# Altium schematic sheet 1_P1.schdoc
size 307 x 218 mm; Symbol: Drawing-Symbol_A4; Device: Drawing-Symbol_A4; Company: wenfeng110402; Drawed: 叶文峰; Reviewed: 叶文峰; Version: V1.0; Page Size: A4; @Project Name: hackpod; @Page Count: 1; @Update Date: 2025-12-13; @Create Date: 2025-11-21; @Schematic Name: Schematic1; @Page No: 1; @Page Name: P1; @Board Name: Board1; @Create Time: 22:44:27; @Update Time: 21:42:18; Title Block Position: 3; Size: A4; Width: 1170; Height: 825; Region Start: 1; X Region Count: 6; Y Region Count: 4; Blade Width: 10
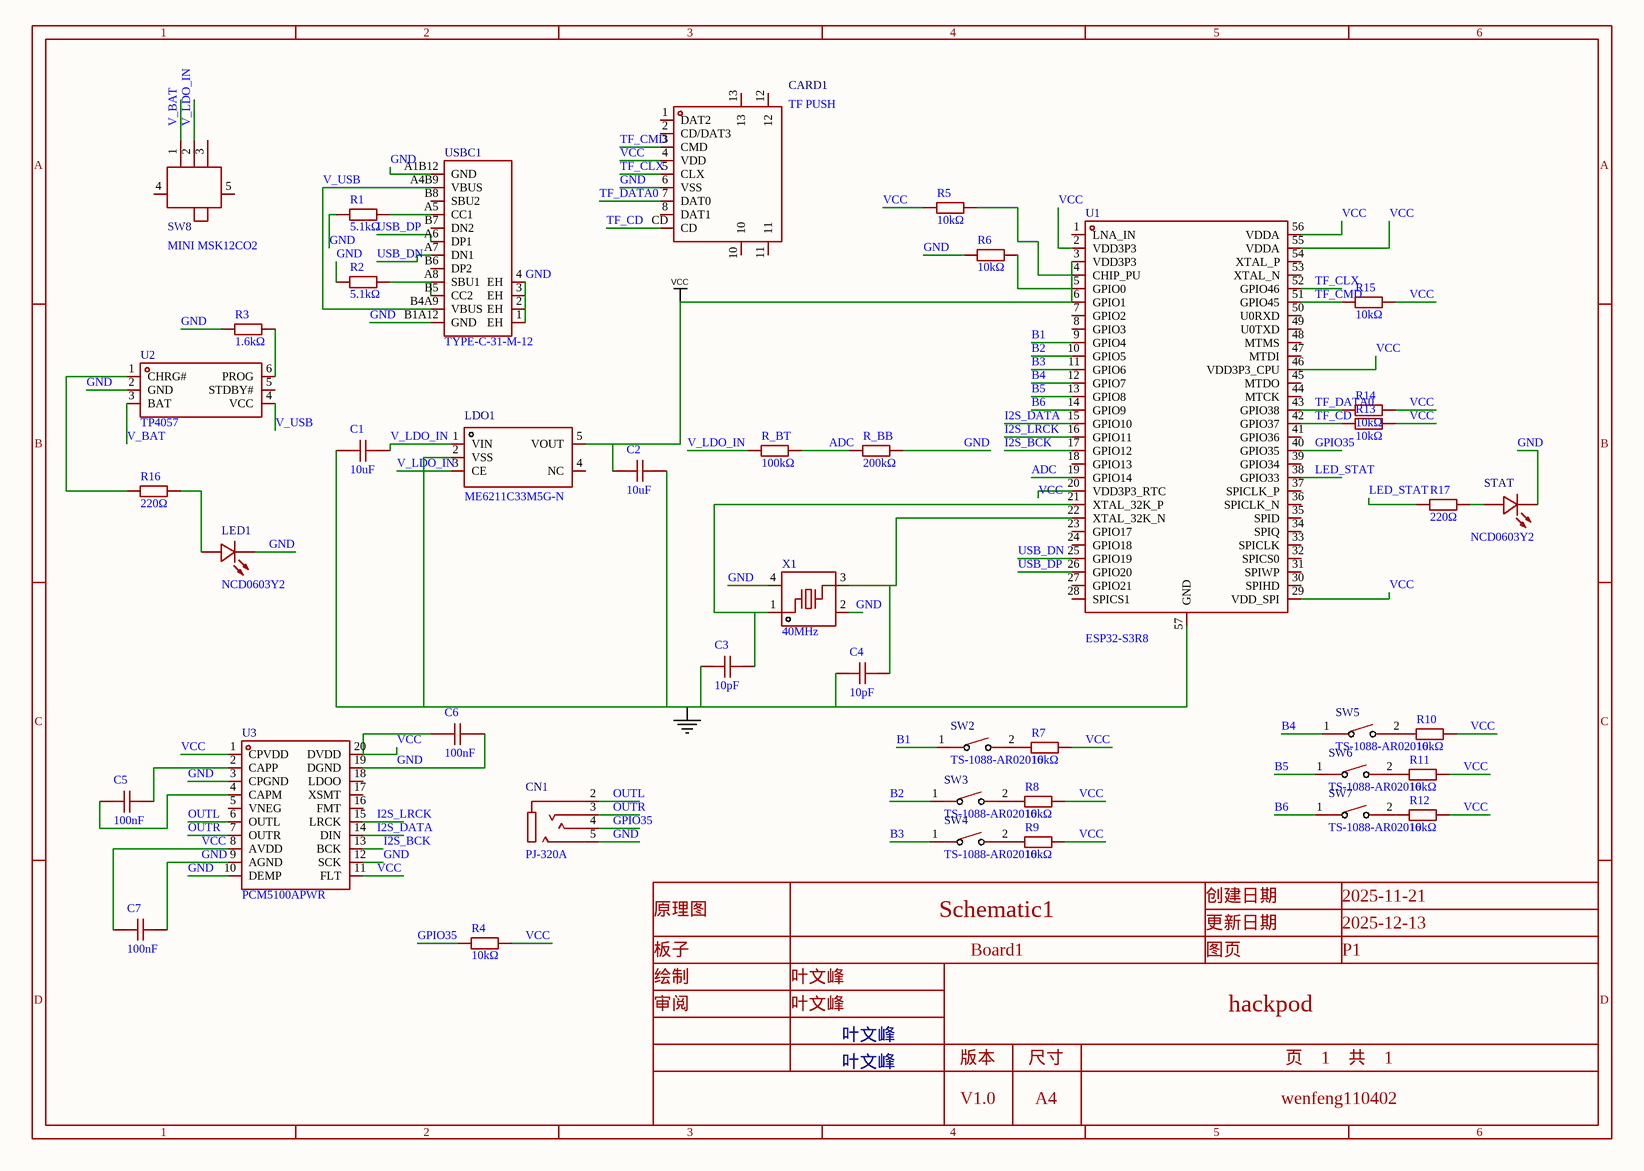
[diagram p0: 1_P1.schdoc]

## Parts
C1  10uF  [C0603]
C2  10uF  [C0603]
C3  10pF  [C0603]
C4  10pF  [C0603]
C5  100nF  [C0603]
C6  100nF  [C0603]
C7  100nF  [C0603]
CARD1  TF PUSH  [TF-SMD_TF-PUSH]
CN1  PJ-320A  [AUDIO-TH_PJ-320A_C49284721]
LDO1  ME6211C33M5G-N  [SOT-23-5_L3.0-W1.7-P0.95-LS2.8-BL]
LED1  NCD0603Y2  [LED0603-RD]
R1  5.1kΩ  [R0603]
R2  5.1kΩ  [R0603]
R3  1.6kΩ  [R0603]
R4  10kΩ  [R0603]
R5  10kΩ  [R0603]
R6  10kΩ  [R0603]
R7  10kΩ  [R0603]
R8  10kΩ  [R0603]
R9  10kΩ  [R0603]
R10  10kΩ  [R0603]
R11  10kΩ  [R0603]
R12  10kΩ  [R0603]
R13  10kΩ  [R0603]
R14  10kΩ  [R0603]
R15  10kΩ  [R0603]
R16  220Ω  [R0603]
R17  220Ω  [R0603]
R_BB  200kΩ  [R0603]
R_BT  100kΩ  [R0603]
STAT  NCD0603Y2  [LED0603-RD]
SW2  TS-1088-AR02016  [SW-SMD_L3.9-W3.0-P4.45]
SW3  TS-1088-AR02016  [SW-SMD_L3.9-W3.0-P4.45]
SW4  TS-1088-AR02016  [SW-SMD_L3.9-W3.0-P4.45]
SW5  TS-1088-AR02016  [SW-SMD_L3.9-W3.0-P4.45]
SW6  TS-1088-AR02016  [SW-SMD_L3.9-W3.0-P4.45]
SW7  TS-1088-AR02016  [SW-SMD_L3.9-W3.0-P4.45]
SW8  MINI MSK12CO2  [SW-SMD_MSK12CO2]
U1  ESP32-S3R8  [QFN-56_L7.0-W7.0-P0.40-TL-EP4.0]
U2  TP4057  [SOT-23-6_L2.9-W1.6-P0.95-LS2.8-BR]
U3  PCM5100APWR  [TSSOP-20_L6.5-W4.4-P0.65-LS6.4-BL]
USBC1  TYPE-C-31-M-12  [USB-C_SMD-TYPE-C-31-M-12_1]
X1  40MHz  [CRYSTAL-SMD_4P-L3.2-W2.5-BL]

## Nets
GND: C1.1 C2.2 C3.1 C4.1 C6.2 C7.2 CARD1.6(VSS) CN1.5 LDO1.2(VSS) LED1.1(K) R1.1 R2.1 R3.1 R6.1 R_BB.2 STAT.1(K) U1.57(GND) U2.2(GND) U3.3(CPGND) U3.9(AGND) U3.10(DEMP) U3.12(SCK) U3.19(DGND) USBC1.1(EH) USBC1.2(EH) USBC1.3(EH) USBC1.4(EH) USBC1.A1B12(GND) USBC1.B1A12(GND) X1.2(GND) X1.4(GND)
VCC: C2.1 C6.1 C7.1 CARD1.4(VDD) LDO1.5(VOUT) R4.2 R5.1 R5.2 R6.2 R7.2 R8.2 R9.2 R10.2 R11.2 R12.2 R13.2 R14.2 R15.2 U1.2(VDD3P3) U1.3(VDD3P3) U1.4(CHIP_PU) U1.5(GPIO0) U1.6(GPIO1) U1.20(VDD3P3_RTC) U1.29(VDD_SPI) U1.46(VDD3P3_CPU) U1.55(VDDA) U1.56(VDDA) U3.1(CPVDD) U3.8(AVDD) U3.11(FLT) U3.20(DVDD)
ADC: R_BB.1 R_BT.2 U1.19(GPIO14)
B1: SW2.1 U1.9(GPIO4)
B2: SW3.1 U1.10(GPIO5)
B3: SW4.1 U1.11(GPIO6)
B4: SW5.1 U1.12(GPIO7)
B5: SW6.1 U1.13(GPIO8)
B6: SW7.1 U1.14(GPIO9)
GPIO35: CN1.4 R4.1 U1.40(GPIO35)
I2S_BCK: U1.17(GPIO12) U3.13(BCK)
I2S_DATA: U1.15(GPIO10) U3.14(DIN)
I2S_LRCK: U1.16(GPIO11) U3.15(LRCK)
LED_STAT: R17.1 U1.38(GPIO33)
OUTL: CN1.2 U3.6(OUTL)
OUTR: CN1.3 U3.7(OUTR)
TF_CD: CARD1.CD R13.1 U1.42(GPIO37)
TF_CLX: CARD1.5(CLX) U1.52(GPIO46)
TF_CMD: CARD1.3(CMD) R15.1 U1.51(GPIO45)
TF_DATA0: CARD1.7(DAT0) R14.1 U1.43(GPIO38)
USB_DN: U1.25(GPIO19) USBC1.A7(DN1)
USB_DP: U1.26(GPIO20) USBC1.A6(DP1)
V_BAT: SW8.1 U2.3(BAT)
V_LDO_IN: C1.2 LDO1.1(VIN) LDO1.3(CE) R_BT.1 SW8.2
V_USB: U2.4(VCC) USBC1.A4B9(VBUS) USBC1.B4A9(VBUS)
NetC3_2: C3.2 U1.21(XTAL_32K_P) X1.1
NetC4_2: C4.2 U1.22(XTAL_32K_N) X1.3
NetC5_1: C5.1 U3.4(CAPM)
NetC5_2: C5.2 U3.2(CAPP)
NetLED1_2: LED1.2(A) R16.2
NetR1_2: R1.2 USBC1.A5(CC1)
NetR2_2: R2.2 USBC1.A8(SBU1) USBC1.B5(CC2)
NetR3_2: R3.2 U2.6(PROG)
NetR7_1: R7.1 SW2.2
NetR8_1: R8.1 SW3.2
NetR9_1: R9.1 SW4.2
NetR10_1: R10.1 SW5.2
NetR11_1: R11.1 SW6.2
NetR12_1: R12.1 SW7.2
NetR16_1: R16.1 U2.1(CHRG#)
NetR17_2: R17.2 STAT.2(A)

Not connected (* = marked no-connect by the designer): CARD1 1(DAT2) 2(CD/DAT3) 8(DAT1) 10 11 12 13; LDO1 4(NC); SW8 3 4 5; U1 1(LNA_IN) 7(GPIO2) 8(GPIO3) 18(GPIO13) 23(GPIO17) 24(GPIO18) 27(GPIO21) 28(SPICS1) 30(SPIHD) 31(SPIWP) 32(SPICS0) 33(SPICLK) 34(SPIQ) 35(SPID) 36(SPICLK_N) 37(SPICLK_P) 39(GPIO34) 41(GPIO36) 44(MTCK) 45(MTDO) 47(MTDI) 48(MTMS) 49(U0TXD) 50(U0RXD) 53(XTAL_N) 54(XTAL_P); U2 5(STDBY#); U3 5(VNEG) 16(FMT) 17(XSMT) 18(LDOO); USBC1 B6(DP2) B7(DN2) B8(SBU2)

## Notes on the sheet
- 1
- 2
- 3
- 4
- 5
- 6
- A
- B
- C
- 原理图
- Schematic1
- 创建日期
- 更新日期
- 2025-11-21
- 2025-12-13
- 板子
- 绘制
- 叶文峰
- Board1
- 图页
- P1
- D
- 审阅
- 版本
- 尺寸
- hackpod
- 页    1    共    1
- V1.0
- A4
- wenfeng110402

## Library data of the parts
C1 C2 = CL10A106MA8NRNC: Manufacturer: SAMSUNG(三星); Symbol: Capacitance; Add into BOM: yes; Tolerance: ±20%; Voltage Rating: 25V; Temperature Coefficient: X5R; Device: CL10A106MA8NRNC; LCSC Part Name: 10uF ±20% 25V; Supplier Part: C96446; Manufacturer Part: CL10A106MA8NRNC; Supplier Footprint: 0603; JLCPCB Part Class: Basic Part; Datasheet: https://item.szlcsc.com/datasheet/CL10A106MA8NRNC/97651.html; Supplier: LCSC; Convert to PCB: yes; Value: 10uF
C3 = CL10C100JB8NNNC: Manufacturer: SAMSUNG(三星); Symbol: Capacitance; Add into BOM: yes; Tolerance: ±5%; Voltage Rating: 50V; Temperature Coefficient: C0G; Channel ID: $1e1234; Device: CL10C100JB8NNNC; LCSC Part Name: 10pF ±5% 50V; Supplier Part: C1634; Manufacturer Part: CL10C100JB8NNNC; Supplier Footprint: 0603; JLCPCB Part Class: Basic Part; Datasheet: https://item.szlcsc.com/datasheet/CL10C100JB8NNNC/1986.html; Supplier: LCSC; Convert to PCB: yes; Value: 10pF; FootprintName: C0603; DeviceName: CL10C100JB8NNNC
C4 = CL10C100JB8NNNC: Manufacturer: SAMSUNG(三星); Symbol: Capacitance; Add into BOM: yes; Tolerance: ±5%; Voltage Rating: 50V; Temperature Coefficient: C0G; Channel ID: $1e1264; Device: CL10C100JB8NNNC; LCSC Part Name: 10pF ±5% 50V; Supplier Part: C1634; Manufacturer Part: CL10C100JB8NNNC; Supplier Footprint: 0603; JLCPCB Part Class: Basic Part; Datasheet: https://item.szlcsc.com/datasheet/CL10C100JB8NNNC/1986.html; Supplier: LCSC; Convert to PCB: yes; Value: 10pF; FootprintName: C0603; DeviceName: CL10C100JB8NNNC
C5 = CL10B104KB8NNNC: Manufacturer: SAMSUNG(三星); Symbol: Capacitance; Add into BOM: yes; Tolerance: ±10%; Voltage Rating: 50V; Temperature Coefficient: X7R; Channel ID: $1e2786; Device: CL10B104KB8NNNC; LCSC Part Name: 100nF ±10% 50V; Supplier Part: C1591; Manufacturer Part: CL10B104KB8NNNC; Supplier Footprint: 0603; JLCPCB Part Class: Extended Part; Datasheet: https://item.szlcsc.com/datasheet/CL10B104KB8NNNC/1943.html; Supplier: LCSC; Convert to PCB: yes; Value: 100nF; FootprintName: C0603; DeviceName: CL10B104KB8NNNC
C6 = CL10B104KB8NNNC: Manufacturer: SAMSUNG(三星); Symbol: Capacitance; Add into BOM: yes; Tolerance: ±10%; Voltage Rating: 50V; Temperature Coefficient: X7R; Channel ID: $1e3067; Device: CL10B104KB8NNNC; LCSC Part Name: 100nF ±10% 50V; Supplier Part: C1591; Manufacturer Part: CL10B104KB8NNNC; Supplier Footprint: 0603; JLCPCB Part Class: Extended Part; Datasheet: https://item.szlcsc.com/datasheet/CL10B104KB8NNNC/1943.html; Supplier: LCSC; Convert to PCB: yes; Value: 100nF; FootprintName: C0603; DeviceName: CL10B104KB8NNNC
C7 = CL10B104KB8NNNC: Manufacturer: SAMSUNG(三星); Symbol: Capacitance; Add into BOM: yes; Tolerance: ±10%; Voltage Rating: 50V; Temperature Coefficient: X7R; Channel ID: $1e3097; Device: CL10B104KB8NNNC; LCSC Part Name: 100nF ±10% 50V; Supplier Part: C1591; Manufacturer Part: CL10B104KB8NNNC; Supplier Footprint: 0603; JLCPCB Part Class: Extended Part; Datasheet: https://item.szlcsc.com/datasheet/CL10B104KB8NNNC/1943.html; Supplier: LCSC; Convert to PCB: yes; Value: 100nF; FootprintName: C0603; DeviceName: CL10B104KB8NNNC
CARD1 = TF PUSH: Manufacturer: SHOU HAN(首韩); Add into BOM: yes; Card Connection Mode: 自弹式; Card Type: MicroSD卡(TF卡); Connector Type: 卡座; Additional Card Detection Pins: 无; Symbol: TF PUSH; Device: TF PUSH; LCSC Part Name: 自弹式 MicroSD卡(TF卡) 卡座; Supplier Part: C393941; Manufacturer Part: TF PUSH; Supplier Footprint: SMD; JLCPCB Part Class: 扩展库; Datasheet: https://item.szlcsc.com/datasheet/TF%2520PUSH/372553.html; Supplier: LCSC; Convert to PCB: yes; Supplementary Features: -; Height Above Board: 2mm; Operating Temperature: -25℃~+90℃
CN1 = PJ-320A_C49284721: Manufacturer: XUNPU(讯普); Add into BOM: yes; Connector Type: 3.5mm耳机座; Current Rating: 500mA; Voltage Rating (Max): 30V; Symbol: PJ-320A_C49284721; Device: PJ-320A_C49284721; LCSC Part Name: 3.5mm耳机座; Supplier Part: C49284721; Manufacturer Part: PJ-320A; Supplier Footprint: SMD; JLCPCB Part Class: 扩展库; Datasheet: https://item.szlcsc.com/datasheet/PJ-320A/51736270.html; Supplier: LCSC; Convert to PCB: yes; Contact Material: 铜; Contact Plating: 金; Operating Temperature: -25℃~+85℃
LDO1 = ME6211C33M5G-N: Manufacturer: MICRONE(南京微盟); Add into BOM: yes; Output Type: 固定; Voltage - Supply: 6V; Output Voltage: 3.3V; Output Current: 500mA; Power Supply Rejection Ratio (PSRR): 70dB@(1kHz); Voltage Dropout: 120mV@(100mA); standby current: 60uA; Noise: 50uVrms; Output Configuration: 正极; Number of Outputs: 1; Symbol: ME6211C33M5G-N; Device: ME6211C33M5G-N; LCSC Part Name: 输入6V 输出3.3V 500mA; Supplier Part: C82942; Manufacturer Part: ME6211C33M5G-N; Supplier Footprint: SOT-23-5; JLCPCB Part Class: 扩展库; Datasheet: https://item.szlcsc.com/datasheet/ME6211C33M5G-N/84106.html; Supplier: LCSC; Convert to PCB: yes; Features: 过流保护；带使能；短路保护; Operating Temperature: -40℃~+150℃
LED1 STAT = NCD0603Y2: Manufacturer: 国星光电; Symbol: FC-1608YXK-585F08; Add into BOM: yes; Emitted Color: 黄色; Forward Voltage (VF): 1.6V~2.6V; Power Dissipation: 65mW; Forward Current: 20mA; Dominant Wavelength: 586nm~595nm; Lens Color: 无色透明透镜; Luminous Intensity: 100mcd~220mcd; Viewing Angle: 130°; Device: NCD0603Y2; LCSC Part Name: NCD0603Y2; Supplier Part: C89811; Manufacturer Part: NCD0603Y2; Supplier Footprint: 0603; JLCPCB Part Class: 扩展库; Datasheet: https://atta.szlcsc.com/upload/public/pdf/source/20200820/C89811_7FE84B429B6BCA3E113B125EE1452576.pdf; Supplier: LCSC; Convert to PCB: yes; Operating Temperature: -30℃~+85℃
R1 = 0603WAF5101T5E: Manufacturer: UNI-ROYAL(厚声); Symbol: 电阻; Add into BOM: yes; Tolerance: ±1%; Power(Watts): 100mW; Voltage-Supply(Max): 75V; Temperature Coefficient: ±100ppm/℃; Channel ID: $1e1980; Device: 0603WAF5101T5E; LCSC Part Name: 5.1kΩ ±1% 100mW 厚膜电阻; Supplier Part: C23186; Manufacturer Part: 0603WAF5101T5E; Supplier Footprint: 0603; JLCPCB Part Class: Basic Part; Datasheet: https://item.szlcsc.com/datasheet/0603WAF5101T5E/23913.html; Supplier: LCSC; Convert to PCB: yes; Type: 厚膜电阻; Value: 5.1kΩ; Operating Temperature: -55℃~+155℃; FootprintName: R0603; DeviceName: 0603WAF5101T5E
R2 = 0603WAF5101T5E: Manufacturer: UNI-ROYAL(厚声); Symbol: 电阻; Add into BOM: yes; Tolerance: ±1%; Power(Watts): 100mW; Voltage-Supply(Max): 75V; Temperature Coefficient: ±100ppm/℃; Channel ID: $1e2010; Device: 0603WAF5101T5E; LCSC Part Name: 5.1kΩ ±1% 100mW 厚膜电阻; Supplier Part: C23186; Manufacturer Part: 0603WAF5101T5E; Supplier Footprint: 0603; JLCPCB Part Class: Basic Part; Datasheet: https://item.szlcsc.com/datasheet/0603WAF5101T5E/23913.html; Supplier: LCSC; Convert to PCB: yes; Type: 厚膜电阻; Value: 5.1kΩ; Operating Temperature: -55℃~+155℃; FootprintName: R0603; DeviceName: 0603WAF5101T5E
R3 = ERA3AEB162V: Manufacturer: PANASONIC(松下); Symbol: 电阻; Add into BOM: yes; Tolerance: ±0.1%; Power(Watts): 100mW; Overload Voltage (Max): 75V; Temperature Coefficient: ±25ppm/℃; Channel ID: $1e2136; Device: ERA3AEB162V; LCSC Part Name: 1.6kΩ ±0.1% 100mW 薄膜电阻; Supplier Part: C473232; Manufacturer Part: ERA3AEB162V; Supplier Footprint: 0603; JLCPCB Part Class: Extended Part; Datasheet: https://atta.szlcsc.com/upload/public/pdf/source/20200407/C473232_8F961CC49DDE14D5C98156D145671F58.pdf; Supplier: LCSC; Convert to PCB: yes; Type: 薄膜电阻; Value: 1.6kΩ; Operating Temperature Range: -55℃~+155℃; FootprintName: R0603; DeviceName: ERA3AEB162V
R4 = 0603WAF1002T5E: Manufacturer: UNI-ROYAL(厚声); Symbol: 电阻; Add into BOM: yes; Tolerance: ±1%; Power(Watts): 100mW; Voltage-Supply(Max): 75V; Temperature Coefficient: ±100ppm/℃; Channel ID: $1e3195; Device: 0603WAF1002T5E; LCSC Part Name: 厚膜电阻 10kΩ ±1% 100mW; Supplier Part: C25804; Manufacturer Part: 0603WAF1002T5E; Supplier Footprint: 0603; JLCPCB Part Class: Basic Part; Datasheet: https://item.szlcsc.com/datasheet/0603WAF1002T5E/26547.html; Supplier: LCSC; Convert to PCB: yes; Type: 厚膜电阻; Value: 10kΩ; Operating Temperature: -55℃~+155℃; FootprintName: R0603; DeviceName: 0603WAF1002T5E
R5 = 0603WAF1002T5E: Manufacturer: UNI-ROYAL(厚声); Symbol: 电阻; Add into BOM: yes; Tolerance: ±1%; Power(Watts): 100mW; Voltage-Supply(Max): 75V; Temperature Coefficient: ±100ppm/℃; Channel ID: $1e3264; Device: 0603WAF1002T5E; LCSC Part Name: 厚膜电阻 10kΩ ±1% 100mW; Supplier Part: C25804; Manufacturer Part: 0603WAF1002T5E; Supplier Footprint: 0603; JLCPCB Part Class: Basic Part; Datasheet: https://item.szlcsc.com/datasheet/0603WAF1002T5E/26547.html; Supplier: LCSC; Convert to PCB: yes; Type: 厚膜电阻; Value: 10kΩ; Operating Temperature: -55℃~+155℃; FootprintName: R0603; DeviceName: 0603WAF1002T5E
R6 = 0603WAF1002T5E: Manufacturer: UNI-ROYAL(厚声); Symbol: 电阻; Add into BOM: yes; Tolerance: ±1%; Power(Watts): 100mW; Voltage-Supply(Max): 75V; Temperature Coefficient: ±100ppm/℃; Channel ID: $1e3294; Device: 0603WAF1002T5E; LCSC Part Name: 厚膜电阻 10kΩ ±1% 100mW; Supplier Part: C25804; Manufacturer Part: 0603WAF1002T5E; Supplier Footprint: 0603; JLCPCB Part Class: Basic Part; Datasheet: https://item.szlcsc.com/datasheet/0603WAF1002T5E/26547.html; Supplier: LCSC; Convert to PCB: yes; Type: 厚膜电阻; Value: 10kΩ; Operating Temperature: -55℃~+155℃; FootprintName: R0603; DeviceName: 0603WAF1002T5E
R7 = 0603WAF1002T5E: Manufacturer: UNI-ROYAL(厚声); Symbol: 电阻; Add into BOM: yes; Tolerance: ±1%; Power(Watts): 100mW; Voltage-Supply(Max): 75V; Temperature Coefficient: ±100ppm/℃; Channel ID: $1e3738; Device: 0603WAF1002T5E; LCSC Part Name: 厚膜电阻 10kΩ ±1% 100mW; Supplier Part: C25804; Manufacturer Part: 0603WAF1002T5E; Supplier Footprint: 0603; JLCPCB Part Class: Basic Part; Datasheet: https://item.szlcsc.com/datasheet/0603WAF1002T5E/26547.html; Supplier: LCSC; Convert to PCB: yes; Type: 厚膜电阻; Value: 10kΩ; Operating Temperature: -55℃~+155℃; FootprintName: R0603; DeviceName: 0603WAF1002T5E
R8 = 0603WAF1002T5E: Manufacturer: UNI-ROYAL(厚声); Symbol: 电阻; Add into BOM: yes; Tolerance: ±1%; Power(Watts): 100mW; Voltage-Supply(Max): 75V; Temperature Coefficient: ±100ppm/℃; Channel ID: $1e3770; Device: 0603WAF1002T5E; LCSC Part Name: 厚膜电阻 10kΩ ±1% 100mW; Supplier Part: C25804; Manufacturer Part: 0603WAF1002T5E; Supplier Footprint: 0603; JLCPCB Part Class: Basic Part; Datasheet: https://item.szlcsc.com/datasheet/0603WAF1002T5E/26547.html; Supplier: LCSC; Convert to PCB: yes; Type: 厚膜电阻; Value: 10kΩ; Operating Temperature: -55℃~+155℃; FootprintName: R0603; DeviceName: 0603WAF1002T5E
R9 = 0603WAF1002T5E: Manufacturer: UNI-ROYAL(厚声); Symbol: 电阻; Add into BOM: yes; Tolerance: ±1%; Power(Watts): 100mW; Voltage-Supply(Max): 75V; Temperature Coefficient: ±100ppm/℃; Channel ID: $1e3802; Device: 0603WAF1002T5E; LCSC Part Name: 厚膜电阻 10kΩ ±1% 100mW; Supplier Part: C25804; Manufacturer Part: 0603WAF1002T5E; Supplier Footprint: 0603; JLCPCB Part Class: Basic Part; Datasheet: https://item.szlcsc.com/datasheet/0603WAF1002T5E/26547.html; Supplier: LCSC; Convert to PCB: yes; Type: 厚膜电阻; Value: 10kΩ; Operating Temperature: -55℃~+155℃; FootprintName: R0603; DeviceName: 0603WAF1002T5E
R10 = 0603WAF1002T5E: Manufacturer: UNI-ROYAL(厚声); Symbol: 电阻; Add into BOM: yes; Tolerance: ±1%; Power(Watts): 100mW; Voltage-Supply(Max): 75V; Temperature Coefficient: ±100ppm/℃; Channel ID: $1e3834; Device: 0603WAF1002T5E; LCSC Part Name: 厚膜电阻 10kΩ ±1% 100mW; Supplier Part: C25804; Manufacturer Part: 0603WAF1002T5E; Supplier Footprint: 0603; JLCPCB Part Class: Basic Part; Datasheet: https://item.szlcsc.com/datasheet/0603WAF1002T5E/26547.html; Supplier: LCSC; Convert to PCB: yes; Type: 厚膜电阻; Value: 10kΩ; Operating Temperature: -55℃~+155℃; FootprintName: R0603; DeviceName: 0603WAF1002T5E
R11 = 0603WAF1002T5E: Manufacturer: UNI-ROYAL(厚声); Symbol: 电阻; Add into BOM: yes; Tolerance: ±1%; Power(Watts): 100mW; Voltage-Supply(Max): 75V; Temperature Coefficient: ±100ppm/℃; Channel ID: $1e3866; Device: 0603WAF1002T5E; LCSC Part Name: 厚膜电阻 10kΩ ±1% 100mW; Supplier Part: C25804; Manufacturer Part: 0603WAF1002T5E; Supplier Footprint: 0603; JLCPCB Part Class: Basic Part; Datasheet: https://item.szlcsc.com/datasheet/0603WAF1002T5E/26547.html; Supplier: LCSC; Convert to PCB: yes; Type: 厚膜电阻; Value: 10kΩ; Operating Temperature: -55℃~+155℃; FootprintName: R0603; DeviceName: 0603WAF1002T5E
R12 = 0603WAF1002T5E: Manufacturer: UNI-ROYAL(厚声); Symbol: 电阻; Add into BOM: yes; Tolerance: ±1%; Power(Watts): 100mW; Voltage-Supply(Max): 75V; Temperature Coefficient: ±100ppm/℃; Channel ID: $1e3898; Device: 0603WAF1002T5E; LCSC Part Name: 厚膜电阻 10kΩ ±1% 100mW; Supplier Part: C25804; Manufacturer Part: 0603WAF1002T5E; Supplier Footprint: 0603; JLCPCB Part Class: Basic Part; Datasheet: https://item.szlcsc.com/datasheet/0603WAF1002T5E/26547.html; Supplier: LCSC; Convert to PCB: yes; Type: 厚膜电阻; Value: 10kΩ; Operating Temperature: -55℃~+155℃; FootprintName: R0603; DeviceName: 0603WAF1002T5E
R13 = 0603WAF1002T5E: Manufacturer: UNI-ROYAL(厚声); Symbol: 电阻; Add into BOM: yes; Tolerance: ±1%; Power(Watts): 100mW; Voltage-Supply(Max): 75V; Temperature Coefficient: ±100ppm/℃; Channel ID: $1e4291; Device: 0603WAF1002T5E; LCSC Part Name: 厚膜电阻 10kΩ ±1% 100mW; Supplier Part: C25804; Manufacturer Part: 0603WAF1002T5E; Supplier Footprint: 0603; JLCPCB Part Class: Basic Part; Datasheet: https://item.szlcsc.com/datasheet/0603WAF1002T5E/26547.html; Supplier: LCSC; Convert to PCB: yes; Type: 厚膜电阻; Value: 10kΩ; Operating Temperature: -55℃~+155℃; FootprintName: R0603; DeviceName: 0603WAF1002T5E
R14 = 0603WAF1002T5E: Manufacturer: UNI-ROYAL(厚声); Symbol: 电阻; Add into BOM: yes; Tolerance: ±1%; Power(Watts): 100mW; Voltage-Supply(Max): 75V; Temperature Coefficient: ±100ppm/℃; Channel ID: $1e4321; Device: 0603WAF1002T5E; LCSC Part Name: 厚膜电阻 10kΩ ±1% 100mW; Supplier Part: C25804; Manufacturer Part: 0603WAF1002T5E; Supplier Footprint: 0603; JLCPCB Part Class: Basic Part; Datasheet: https://item.szlcsc.com/datasheet/0603WAF1002T5E/26547.html; Supplier: LCSC; Convert to PCB: yes; Type: 厚膜电阻; Value: 10kΩ; Operating Temperature: -55℃~+155℃; FootprintName: R0603; DeviceName: 0603WAF1002T5E
R15 = 0603WAF1002T5E: Manufacturer: UNI-ROYAL(厚声); Symbol: 电阻; Add into BOM: yes; Tolerance: ±1%; Power(Watts): 100mW; Voltage-Supply(Max): 75V; Temperature Coefficient: ±100ppm/℃; Channel ID: $1e4351; Device: 0603WAF1002T5E; LCSC Part Name: 厚膜电阻 10kΩ ±1% 100mW; Supplier Part: C25804; Manufacturer Part: 0603WAF1002T5E; Supplier Footprint: 0603; JLCPCB Part Class: Basic Part; Datasheet: https://item.szlcsc.com/datasheet/0603WAF1002T5E/26547.html; Supplier: LCSC; Convert to PCB: yes; Type: 厚膜电阻; Value: 10kΩ; Operating Temperature: -55℃~+155℃; FootprintName: R0603; DeviceName: 0603WAF1002T5E
R16 = FRC0603J221 TS: Manufacturer: FOJAN(富捷); Symbol: 电阻; Add into BOM: yes; Tolerance: ±5%; Power(Watts): 100mW; Voltage-Supply(Max): 75V; Temperature Coefficient: ±100ppm/℃; Channel ID: $1e4502; Device: FRC0603J221 TS; LCSC Part Name: 220Ω ±5% 100mW 厚膜电阻; Supplier Part: C2907127; Manufacturer Part: FRC0603J221 TS; Supplier Footprint: 0603; JLCPCB Part Class: Extended Part; Supplier: LCSC; Convert to PCB: yes; Type: 厚膜电阻; Value: 220Ω; Operating Temperature: -55℃~+155℃; FootprintName: R0603; DeviceName: FRC0603J221 TS
R17 = FRC0603J221 TS: Manufacturer: FOJAN(富捷); Symbol: 电阻; Add into BOM: yes; Tolerance: ±5%; Power(Watts): 100mW; Voltage-Supply(Max): 75V; Temperature Coefficient: ±100ppm/℃; Device: FRC0603J221 TS; LCSC Part Name: 220Ω ±5% 100mW 厚膜电阻; Supplier Part: C2907127; Manufacturer Part: FRC0603J221 TS; Supplier Footprint: 0603; JLCPCB Part Class: Extended Part; Supplier: LCSC; Convert to PCB: yes; Type: 厚膜电阻; Value: 220Ω; Operating Temperature: -55℃~+155℃
R_BB = ERA3AEB204V: Manufacturer: PANASONIC(松下); Symbol: 电阻; Add into BOM: yes; Tolerance: ±0.1%; Power(Watts): 100mW; Overload Voltage (Max): 75V; Temperature Coefficient: ±25ppm/℃; Device: ERA3AEB204V; LCSC Part Name: 200kΩ ±0.1% 100mW 薄膜电阻; Supplier Part: C473261; Manufacturer Part: ERA3AEB204V; Supplier Footprint: 0603; JLCPCB Part Class: Extended Part; Datasheet: https://atta.szlcsc.com/upload/public/pdf/source/20200515/C543414_D3FB4A44C151AC19BA141503575FC797.pdf; Supplier: LCSC; Convert to PCB: yes; Type: 薄膜电阻; Value: 200kΩ; Operating Temperature Range: -55℃~+155℃
R_BT = ERJ3EKF1003V: Manufacturer: PANASONIC(松下); Symbol: 电阻; Add into BOM: yes; Tolerance: ±1%; Power(Watts): 100mW; Temperature Coefficient: ±100ppm/℃; Device: ERJ3EKF1003V; LCSC Part Name: 100kΩ ±1% 100mW 厚膜电阻; Supplier Part: C189597; Manufacturer Part: ERJ3EKF1003V; Supplier Footprint: 0603; JLCPCB Part Class: Extended Part; Datasheet: https://item.szlcsc.com/datasheet/ERJ3EKF1003V/201577.html; Supplier: LCSC; Convert to PCB: yes; Type: 厚膜电阻; Value: 100kΩ; Voltage-Supply(Max): -; Operating Temperature: -55℃~+155℃
SW2-SW7 = TS-1088-AR02016: Manufacturer: XUNPU(讯普); Add into BOM: yes; Circuit: 单刀单掷; Actuator Style: 圆形按钮; Operating Force: 1.6N; Switch Height: 2mm; with Bracket: 不带支架; Contact Current: 50mA; Voltage Rating: 12V; Actuator/Cap Color: 黑色; Life: 10万次; Symbol: TS-1088-AR02016; Device: TS-1088-AR02016; LCSC Part Name: 4*3*2mm 立贴 轻触开关; Supplier Part: C720477; Manufacturer Part: TS-1088-AR02016; Supplier Footprint: SMD,4x3mm; JLCPCB Part Class: 基础库; Datasheet: https://item.szlcsc.com/datasheet/TS-1088-AR02016/763484.html; Supplier: LCSC; Convert to PCB: yes; Mounting Type: 立贴; Length: 4mm; Width: 3mm; Termination Style: SMD接片; Operating Temperature: -30℃~+80℃
SW8 = MINI MSK12CO2: Manufacturer: SHOU HAN(首韩); Add into BOM: yes; Circuit: 单刀双掷; Actuator Style: 矩形柱状; Switch Height: 1.4mm; Actuator Color: 白色; Current Rating: 50mA; Voltage Rating: 12V; Life: 1万次; Symbol: MINI MSK12CO2; Device: MINI MSK12CO2; LCSC Part Name: 迷你七脚两档侧拨拨动 mini七7脚 微型拨动; Supplier Part: C2681570; Manufacturer Part: MINI MSK12CO2; Supplier Footprint: SMD,5x2.8mm; JLCPCB Part Class: 扩展库; Datasheet: https://item.szlcsc.com/datasheet/MINI%2520MSK12CO2/2774913.html; Supplier: LCSC; Convert to PCB: yes; Termination Style: SMD接片; Length: 5mm; Width: 2.75mm; Mounting Type: 卧贴; Operating Temperature: -25℃~+70℃
U1 = ESP32-S3R8: Manufacturer: ESPRESSIF(乐鑫); Symbol: ESP32-S3(R8); Add into BOM: yes; Frequency Range: 2.412GHz~2.484GHz; Interface: I2C；I2S；UART；USB；SPI; Voltage - Supply: 3V~3.6V; Output Power: 18.5dBm; Data Rate: 150Mbps; Current Of Transmitting: 283mA; Sensitivity: -74.2dBm; Receive Current: 88mA; Typical Application Frequency: 2.4GHz; Device: ESP32-S3R8; LCSC Part Name: 2.4GHz Wi-Fi + 低功耗蓝牙系统级芯片（SoC）; Supplier Part: C2913194; Manufacturer Part: ESP32-S3R8; Supplier Footprint: QFN-56(7x7); JLCPCB Part Class: 扩展库; Datasheet: https://item.szlcsc.com/datasheet/ESP32-S3R8/3198292.html; Supplier: LCSC; Convert to PCB: yes; Applications: 蓝牙；IoT；WiFi; Operating Temperature: -40℃~+65℃; Type: 收发器
U2 = TP4057: Manufacturer: UMW(友台半导体); Symbol: TP4057_C725791; Add into BOM: yes; The Chip Type: 充电芯片; Voltage - Supply: 4V~6.5V; Charge Current - Max: 500mA; Charging Saturation Voltage: 4.24V; Type of Battery: 锂离子; Number of Cells: 1; Battery Temperature Detection: 支持; Supply Current (Iq): 25uA; Device: TP4057; LCSC Part Name: TP4057; Supplier Part: C725791; Manufacturer Part: TP4057; Supplier Footprint: SOT-23-6; JLCPCB Part Class: 扩展库; Datasheet: https://item.szlcsc.com/datasheet/TP4057/772194.html; Supplier: LCSC; Convert to PCB: yes; Operating Temperature: -40℃~+85℃
U3 = PCM5100APWR: Manufacturer: TI(德州仪器); Add into BOM: yes; Voltage - Supply: 1.8V~3.3V; Interface Type: I2S; Symbol: PCM5100APWR; Device: PCM5100APWR; LCSC Part Name: 具有PLL和32位、384kHz PCM接口的音频立体声DAC; Supplier Part: C131154; Manufacturer Part: PCM5100APWR; Supplier Footprint: TSSOP-20; JLCPCB Part Class: 扩展库; Datasheet: https://www.ti.com/cn/lit/gpn/pcm5102a; Supplier: LCSC; Convert to PCB: yes
USBC1 = TYPE-C-31-M-12: Manufacturer: 韩国韩荣; Add into BOM: yes; Connector Type: Type-C; Gender: 母; Number of Contacts: 16P; Number of Ports: 1; Current Rating-Power: 5A; Symbol: TYPE-C-31-M-12; Device: TYPE-C-31-M-12; LCSC Part Name: Type-C 母; Supplier Part: C165948; Manufacturer Part: TYPE-C-31-M-12; Supplier Footprint: SMD; JLCPCB Part Class: 扩展库; Datasheet: https://item.szlcsc.com/datasheet/TYPE-C-31-M-12/177331.html; Supplier: LCSC; Convert to PCB: yes; Protocol Standard: -; Mounting Type: -; Operating Temperature: -
X1 = XL2EL89CPI-111YLC-40M: Manufacturer: YXC(扬兴晶振); Add into BOM: yes; Normal temperature Frequency Tolerance: ±10ppm; Load Capacitance: 15pF; Frequency Stability: ±20ppm; Symbol: XL2EL89CPI-111YLC-40M; Device: XL2EL89CPI-111YLC-40M; LCSC Part Name: YSX321SL 40MHZ 4P 3225 15PF ±10PPM -40~85℃ (±20PPM); Supplier Part: C5444549; Manufacturer Part: XL2EL89CPI-111YLC-40M; Supplier Footprint: SMD3225-4P; JLCPCB Part Class: 扩展库; Datasheet: https://item.szlcsc.com/datasheet/XL2EL89CPI-111YLC-40M/6336545.html; Supplier: LCSC; Convert to PCB: yes; Type: 贴片晶振; Value: 40MHz; Operating Temperature: -40℃~+85℃